# EAGLE schematic LPC2101 Breakout (EAGLE 6.0)
DATABASE: ../../../eagle/PARTSDB.TXT
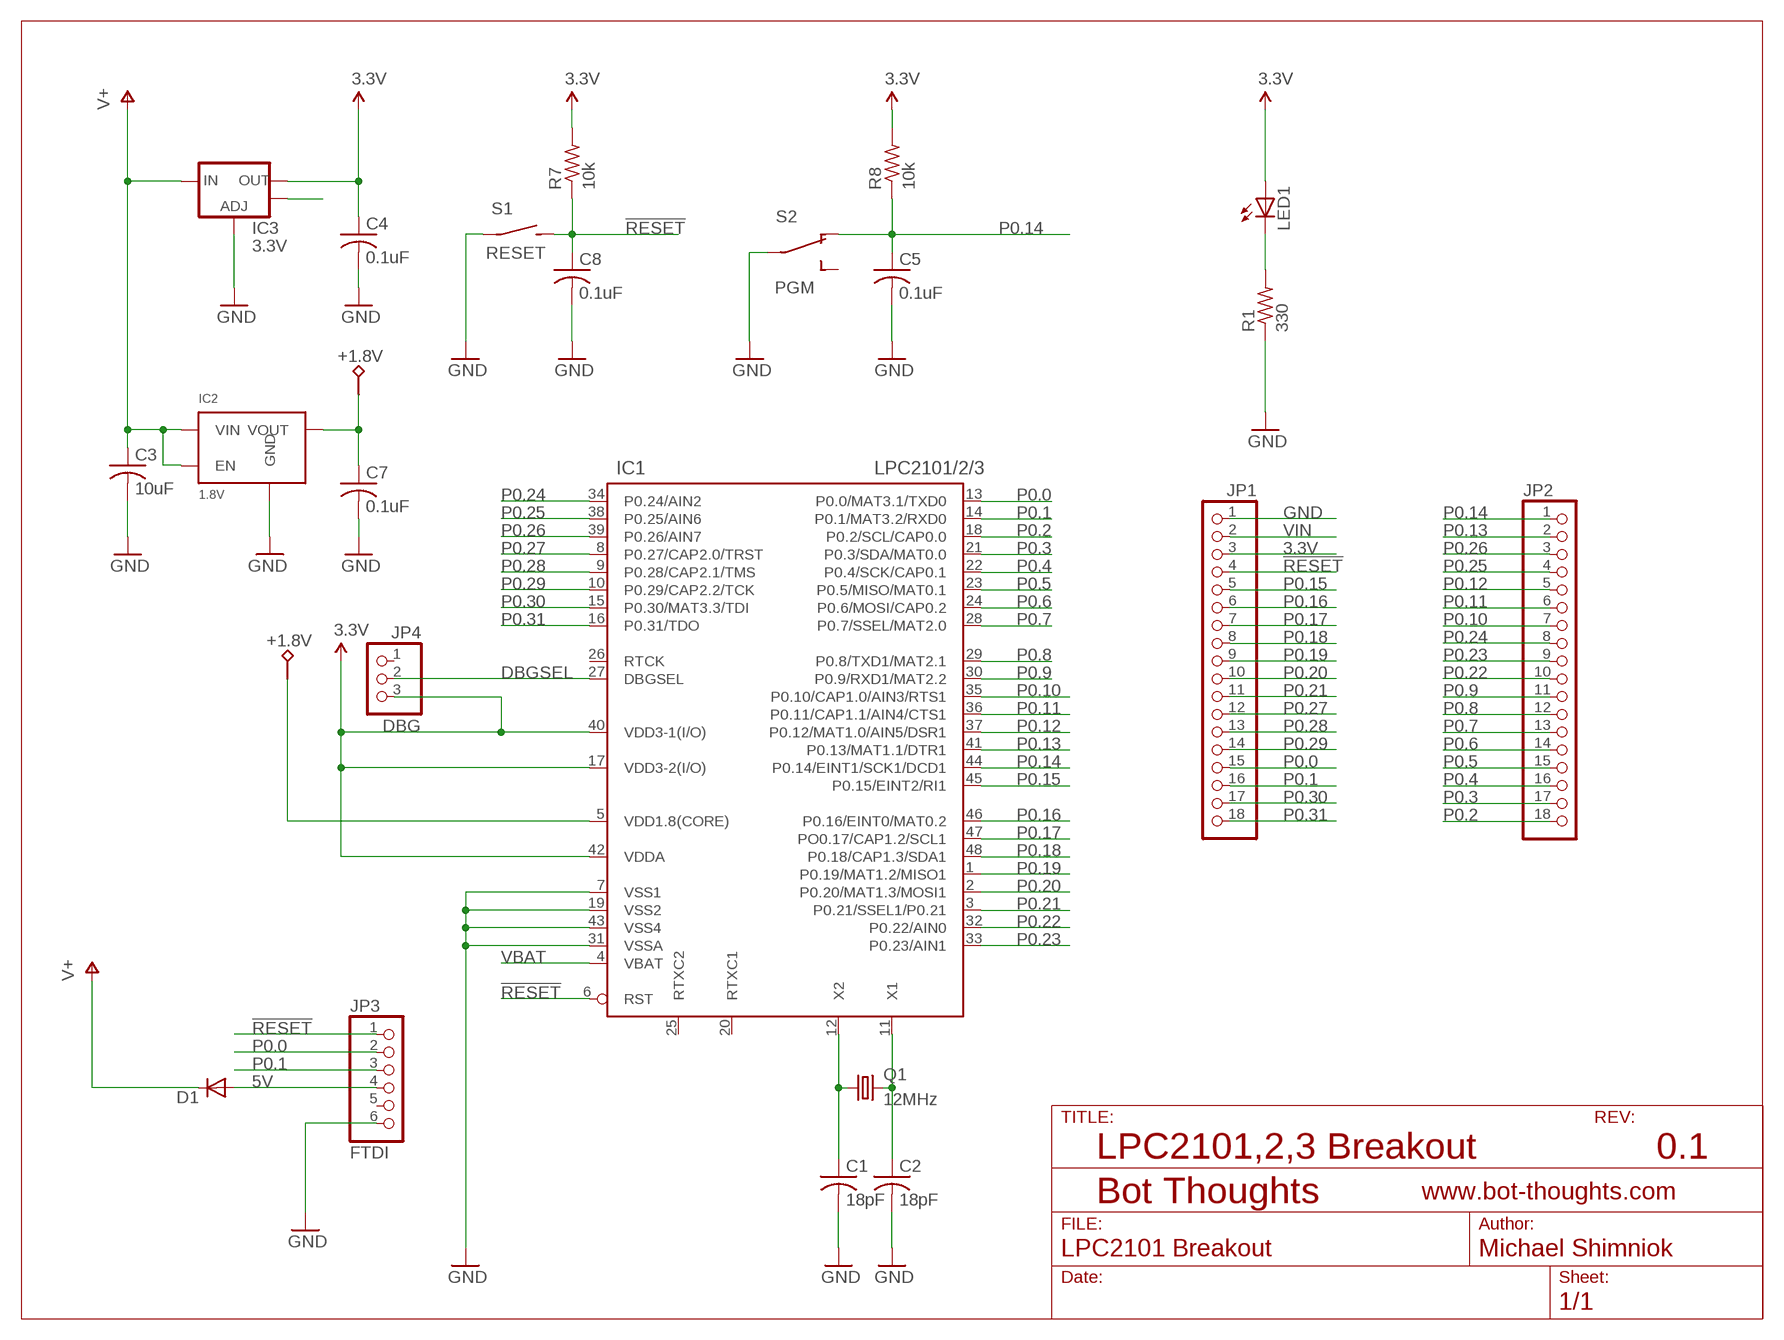
[diagram p0: schematic, sheet 1]

## Parts
C1  18pF  C-USC0603  [C0603]
C2  18pF  C-USC0603  [C0603]
C3  10uF  C-USC0603  [C0603]
C4  0.1uF  C-USC0603  [C0603]
C5  0.1uF  C-USC0603  [C0603]
C7  0.1uF  C-USC0603  [C0603]
C8  0.1uF  C-USC0603  [C0603]
D1  DIODE-SOD123  [SOD123]
IC1  LPC2101/2/3  LPC2103  [LQFP48]
IC2  1.8V  TLV00XX  [SOT23-5]
IC3  3.3V  V_REG_LM1117SOT223  [SOT223]
JP1  PINHD-1X18_2.54-S  [1X18-S]
JP2  PINHD-1X18_2.54-S  [1X18-S]
JP3  FTDI  PINHD-1X06_2.54-S  [1X06-S]
JP4  DBG  PINHD-1X03_2.00  [1X03M]
LED1  LEDCHIPLED_1206  [CHIPLED_1206]
Q1  12MHz  CRYSTALTC26H  [TC26H]
R1  330  R-US_R0603  [R0603]
R7  10k  R-US_R0603  [R0603]
R8  10k  R-US_R0603  [R0603]
S1  RESET  SPSTTACTILE2  [6MMTACTILE]
S2  PGM  SPDT_OS102011MAQN1  [OS102011MA1Q]

## Nets
3.3V: C4.1 IC1.17(VDD3-2(I/O)) IC1.40(VDD3-1(I/O)) IC1.42(VDDA) IC3.2(OUT) JP1.3 JP4.3 LED1.A R7.2 R8.2
5V: D1.A JP3.4
!RESET: C8.1 IC1.6(RST) JP1.4 JP3.1 R7.1 S1.P$2(S)
+1.8V: C7.1 IC1.5(VDD1.8(CORE)) IC2.5(VOUT) ; supply symbol labelled 1.8V
DBGSEL: IC1.27(DBGSEL) JP4.2
GND: C1.2 C2.2 C3.2 C4.2 C5.2 C7.2 C8.2 IC1.7(VSS1) IC1.19(VSS2) IC1.31(VSSA) IC1.43(VSS4) IC2.2(GND) IC3.1(ADJ) JP1.1 JP3.6 R1.1 S1.P$1(P) S2.P$2(P)
HS1: IC3.4(OUT)
N$2: LED1.C R1.2
N$6: C2.1 IC1.11(X1) Q1.2
N$8: C1.1 IC1.12(X2) Q1.1
P0.0: IC1.13(P0.0/MAT3.1/TXD0) JP1.15 JP3.2
P0.1: IC1.14(P0.1/MAT3.2/RXD0) JP1.16 JP3.3
P0.2: IC1.18(P0.2/SCL/CAP0.0) JP2.18
P0.3: IC1.21(P0.3/SDA/MAT0.0) JP2.17
P0.4: IC1.22(P0.4/SCK/CAP0.1) JP2.16
P0.5: IC1.23(P0.5/MISO/MAT0.1) JP2.15
P0.6: IC1.24(P0.6/MOSI/CAP0.2) JP2.14
P0.7: IC1.28(P0.7/SSEL/MAT2.0) JP2.13
P0.8: IC1.29(P0.8/TXD1/MAT2.1) JP2.12
P0.9: IC1.30(P0.9/RXD1/MAT2.2) JP2.11
P0.10: IC1.35(P0.10/CAP1.0/AIN3/RTS1) JP2.7
P0.11: IC1.36(P0.11/CAP1.1/AIN4/CTS1) JP2.6
P0.12: IC1.37(P0.12/MAT1.0/AIN5/DSR1) JP2.5
P0.13: IC1.41(P0.13/MAT1.1/DTR1) JP2.2
P0.14: C5.1 IC1.44(P0.14/EINT1/SCK1/DCD1) JP2.1 R8.1 S2.P$1(O1)
P0.15: IC1.45(P0.15/EINT2/RI1) JP1.5
P0.16: IC1.46(P0.16/EINT0/MAT0.2) JP1.6
P0.17: IC1.47(PO0.17/CAP1.2/SCL1) JP1.7
P0.18: IC1.48(P0.18/CAP1.3/SDA1) JP1.8
P0.19: IC1.1(P0.19/MAT1.2/MISO1) JP1.9
P0.20: IC1.2(P0.20/MAT1.3/MOSI1) JP1.10
P0.21: IC1.3(P0.21/SSEL1/P0.21) JP1.11
P0.22: IC1.32(P0.22/AIN0) JP2.10
P0.23: IC1.33(P0.23/AIN1) JP2.9
P0.24: IC1.34(P0.24/AIN2) JP2.8
P0.25: IC1.38(P0.25/AIN6) JP2.4
P0.26: IC1.39(P0.26/AIN7) JP2.3
P0.27: IC1.8(P0.27/CAP2.0/TRST) JP1.12
P0.28: IC1.9(P0.28/CAP2.1/TMS) JP1.13
P0.29: IC1.10(P0.29/CAP2.2/TCK) JP1.14
P0.30: IC1.15(P0.30/MAT3.3/TDI) JP1.17
P0.31: IC1.16(P0.31/TDO) JP1.18
VBAT: IC1.4(VBAT)
VIN: C3.1 D1.C IC2.1(VIN) IC2.3(EN) IC3.3(IN) JP1.2 ; supply symbol labelled V+
Unconnected: IC1.20(RTXC1) IC1.25(RTXC2) IC1.26(RTCK) JP3.5 JP4.1 S2.P$3(O2)

## Notes on the sheet
- LPC2101,2,3 Breakout | 0.1

## Library data of the parts
C1 C2 = rcl:C-US: CAPACITOR, American symbol; PARTNO: C1608C0G1H180J
C3 = rcl:C-US: CAPACITOR, American symbol; PARTNO: C1608X5R0J106M_DK
C4 C5 C7 = rcl:C-US: CAPACITOR, American symbol; PARTNO: CX0603MRX7R6BB104
C8 = rcl:C-US: CAPACITOR, American symbol; BOM: INCLUDE; PARTNO: CX0603MRX7R6BB104
D1 = diode:DIODE-: DIODE; BOM: INCLUDE; PARTNO: CGRM4001-G
IC1 = mes_arm:LPC2103: LPC2101/2102/2103 microcontroler from Philips; BOM: INCLUDE; PARTNO: LPC2101FBD48,151
IC2 = mes_regulators:TLV00XX: TLV00XX, TLV01XX LDO Voltage Regulator The TLV700xx series of low-dropout (LDO) linear regulators are low quiescent current devices with excellent line and load transient performance. These LDOs are designed for power-sensitive applications. Datasheet: tlv70025.pdf <http://www.ti.com/lit/ds/symlink/tlv70025.pdf>; BOM: INCLUDE; PARTNO: TLV70018DDCT
IC3 = SparkFun:V_REG_LM1117: Voltage Regulator LM1117 Standard adjustable voltage regulator but in SMD form. Spark Fun Electronics SKU : COM-00595; BOM: EXCLUDE; PARTNO: SALVAGE
JP1 JP2 = pinhead-2:PINHD-1X18: PIN HEADER; BOM: EXCLUDE
JP3 = pinhead-2:PINHD-1X06: PIN HEADER; BOM: EXCLUDE
JP4 = pinhead-2:PINHD-1X03: PIN HEADER; BOM: INCLUDE; PARTNO: 951103-8622-AR
LED1 = led:LED: LED OSRAM: - CHIPLED LG R971, LG N971, LY N971, LG Q971, LY Q971, LO R971, LY R971 LH N974, LH R974 LS Q976, LO Q976, LY Q976 LO Q996 - Hyper CHIPLED LW Q18S LB Q993, LB Q99A, LB R99A - SideLED LS A670, LO A670, LY A670, LG A670, LP A670 LB A673, LV A673, LT A673, LW A673 LH A674 LY A675 LS A676, LA A676, LO A676, LY A676, LW A676 LS A679, LY A679, LG A679 - Hyper Micro SIDELED® LS Y876, LA Y876, LO Y876, LY Y876 LT Y87S - SmartLED LW L88C, LW L88S LB L89C, LB L89S, LG L890 LS L89K, LO L89K, LY L89K LS L896, LA L896, LO L896, LY L896 - TOPLED LS T670, LO T670, LY T670, LG T670, LP T670 LSG T670, LSP T670, LSY T670, LOP T670, LYG T670 LG T671, LOG T671, LSG T671 LB T673, LV T673, LT T673, LW T673 LH T674 LS T676, LA T676, LO T676, LY T676, LB T676, LH T676, LSB T676, LW T676 LB T67C, LV T67C, LT T67C, LS T67K, LO T67K, LY T67K, LW E67C LS E67B, LA E67B, LO E67B, LY E67B, LB E67C, LV E67C, LT E67C LW T67C LS T679, LY T679, LG T679 LS T770, LO T770, LY T770, LG T770, LP T770 LB T773, LV T773, LT T773, LW T773 LH T774 LS E675, LA E675, LY E675, LS T675 LS T776, LA T776, LO T776, LY T776, LB T776 LHGB T686 LT T68C, LB T68C - Hyper Mini TOPLED® LB M676 - Mini TOPLED Santana® LG M470 LS M47K, LO M47K, LY M47K Source: http://www.osram.convergy.de LUXEON: - LUMILED® LXK2-PW12-R00, LXK2-PW12-S00, LXK2-PW14-U00, LXK2-PW14-V00 LXK2-PM12-R00, LXK2-PM12-S00, LXK2-PM14-U00 LXK2-PE12-Q00, LXK2-PE12-R00, LXK2-PE12-S00, LXK2-PE14-T00, LXK2-PE14-U00 LXK2-PB12-K00, LXK2-PB12-L00, LXK2-PB12-M00, LXK2-PB14-N00, LXK2-PB14-P00, LXK2-PB14-Q00 LXK2-PR12-L00, LXK2-PR12-M00, LXK2-PR14-Q00, LXK2-PR14-R00 LXK2-PD12-Q00, LXK2-PD12-R00, LXK2-PD12-S00 LXK2-PH12-R00, LXK2-PH12-S00 LXK2-PL12-P00, LXK2-PL12-Q00, LXK2-PL12-R00 Source: www.luxeon.com KINGBRIGHT: KA-3528ASYC Source: www.kingbright.com; BOM: INCLUDE; PARTNO: LG N971-KN-1
Q1 = crystal:CRYSTAL: CRYSTAL; BOM: INCLUDE; OC_FARNELL: unknown; OC_NEWARK: unknown; PARTNO: CSA309-12.000MABJ-UB
R1 = rcl:R-US_: RESISTOR, American symbol; BOM: INCLUDE; PARTNO: ERJ-3GEYJ331V
R7 R8 = rcl:R-US_: RESISTOR, American symbol; BOM: INCLUDE; PARTNO: ERJ-3GEYJ103V
S1 = mes_electromech:SPST: SPST SWITCH; BOM: EXCLUDE; PARTNO: SALVAGE
S2 = mes_electromech:SPDT: MARQUARDT SWITCH; BOM: INCLUDE; PARTNO: OS102011MA1QS1